# Altium project TXRobot-Boutons.PrjPCB
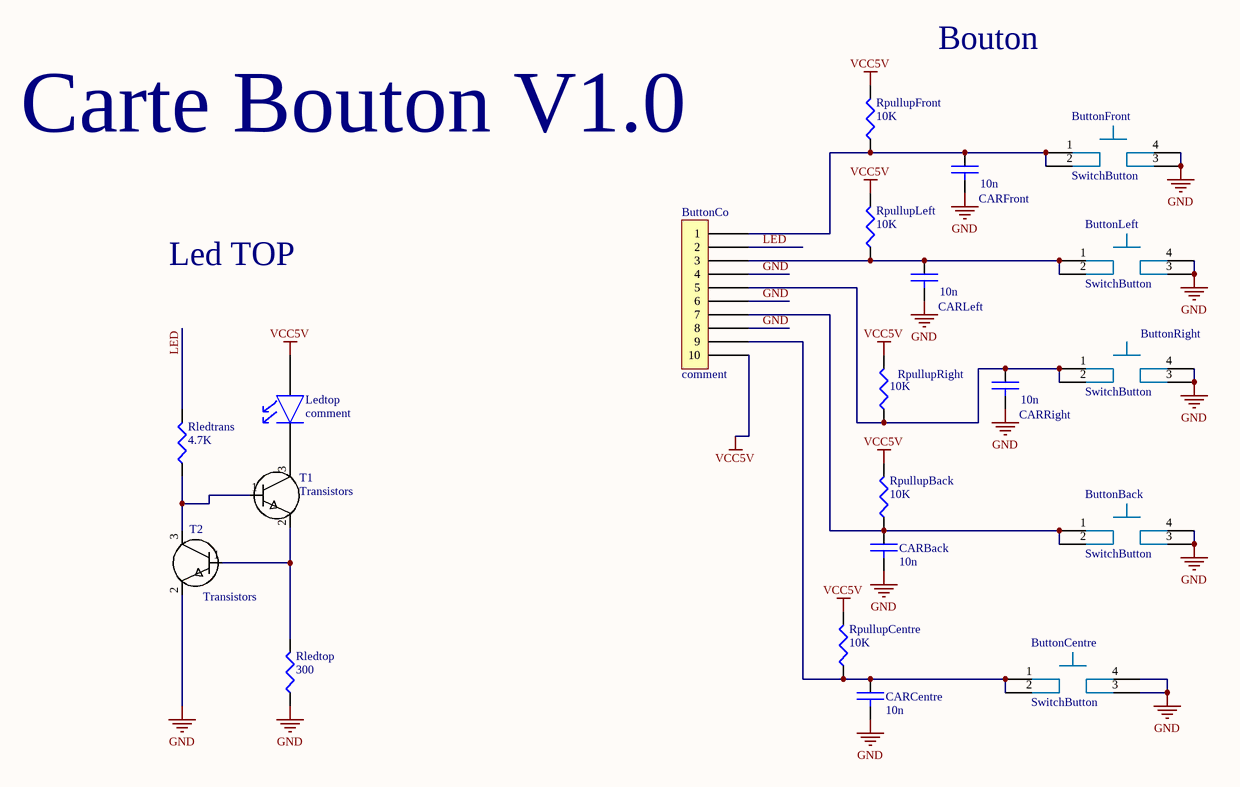
[diagram p0: TXRobot-Boutons.SchDoc]
1 sheet, 21 parts. Net scope: global (net labels, ports and power ports of the same name join across sheets).
Board file: TXRobot-Boutons.PCBDOC

## Sheet TXRobot-Boutons.SchDoc
size A4; PageSetup: Record=PageOptions|CenterHorizontal=True|CenterVertical=True|PrintScale=1.00|XCorrection=1.00|YCorrection=1.00|PrintKind=1|BorderSize=5000000|LeftOffset=0|BottomOffset=0|Orientation=2|PaperLength=2970|PaperWidth=2100|Scale=100|PaperSource=7|PrintQuality=1200|MediaType=1|DitherType=10|PaperKind=A4|PrintScaleMode=1

### Parts
ButtonBack  SwitchButton  [SwitchMedium]
ButtonCentre  SwitchButton  [SwitchMedium]
ButtonCo  comment  [HE10-10V]
ButtonFront  SwitchButton  [SwitchMedium]
ButtonLeft  SwitchButton  [SwitchMedium]
ButtonRight  SwitchButton  [SwitchMedium]
CARBack  value 10n  [0805]  (hidden comment: CAP)
CARCentre  value 10n  [0805]  (hidden comment: CAP)
CARFront  value 10n  [0805]  (hidden comment: CAP)
CARLeft  value 10n  [0805]  (hidden comment: CAP)
CARRight  value 10n  [0805]  (hidden comment: CAP)
Ledtop  comment  [LED1206]
Rledtop  value 300  [0805]  (hidden comment: RES)
Rledtrans  value 4.7K  [0805]  (hidden comment: RES)
RpullupBack  value 10K  [0805]  (hidden comment: RES)
RpullupCentre  value 10K  [0805]  (hidden comment: RES)
RpullupFront  value 10K  [0805]  (hidden comment: RES)
RpullupLeft  value 10K  [0805]  (hidden comment: RES)
RpullupRight  value 10K  [0805]  (hidden comment: RES)
T1  Transistors  [BC817-40]
T2  Transistors  [BC817-40]

### Nets
GND: ButtonBack.3 ButtonBack.4 ButtonCentre.3 ButtonCentre.4 ButtonCo.4 ButtonCo.6 ButtonCo.8 ButtonFront.3 ButtonFront.4 ButtonLeft.3 ButtonLeft.4 ButtonRight.3 ButtonRight.4 CARBack.2 CARCentre.2 CARFront.2 CARLeft.2 CARRight.2 Rledtop.1 T2.2(Emi)
VCC5V: ButtonCo.10 Ledtop.A RpullupBack.2 RpullupCentre.2 RpullupFront.2 RpullupLeft.2 RpullupRight.2
LED: ButtonCo.2 Rledtrans.2
NetButtonBack_1: ButtonBack.1 ButtonBack.2 ButtonCo.7 CARBack.1 RpullupBack.1
NetButtonCentre_1: ButtonCentre.1 ButtonCentre.2 ButtonCo.9 CARCentre.1 RpullupCentre.1
NetButtonCo_1: ButtonCo.1 ButtonFront.1 ButtonFront.2 CARFront.1 RpullupFront.1
NetButtonCo_3: ButtonCo.3 ButtonLeft.1 ButtonLeft.2 CARLeft.1 RpullupLeft.1
NetButtonCo_5: ButtonCo.5 ButtonRight.1 ButtonRight.2 CARRight.1 RpullupRight.1
NetLedtop_K: Ledtop.K T1.3(Co)
NetRledtop_2: Rledtop.2 T1.2(Emi) T2.1(Base)
NetRledtrans_1: Rledtrans.1 T1.1(Base) T2.3(Co)

### Notes on the sheet
- Bouton
- Carte Bouton V1.0
- Led TOP

### Library data of the parts
ButtonCo = HE10-10: 10-pin connector
CARBack CARCentre = CAP: Capa anti rebond
CARFront CARLeft CARRight = CAP: capa Anti rebond
Ledtop = LED: LED 5mm/3mm/CMS
Rledtop Rledtrans RpullupBack RpullupCentre RpullupFront RpullupLeft RpullupRight = RES: resistance